# Altium schematic sheet REV04.SchDoc
size A
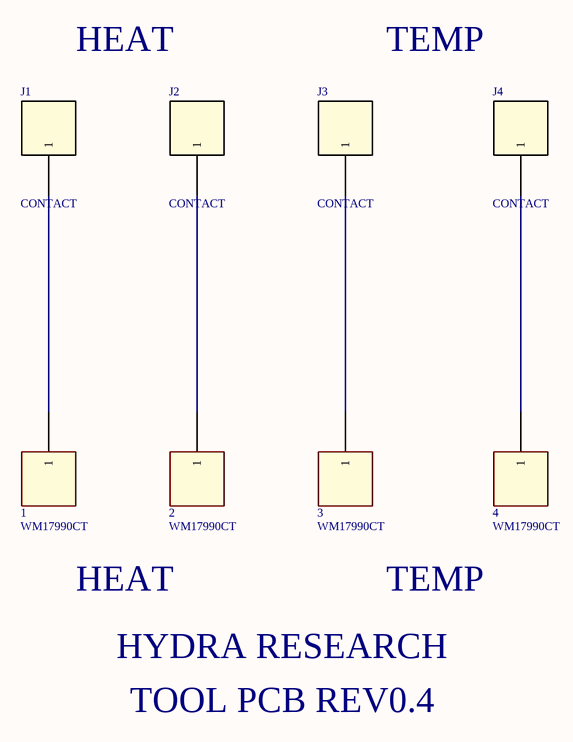
[diagram p0: REV04.SchDoc]

## Parts
1  WM17990CT  [WM17990CT-ND-l]
2  WM17990CT  [WM17990CT-ND-l]
3  WM17990CT  [WM17990CT-ND-l]
4  WM17990CT  [WM17990CT-ND-l]
J1  CONTACT  [CONTRACT PAD]
J2  CONTACT  [CONTRACT PAD]
J3  CONTACT  [CONTRACT PAD]
J4  CONTACT  [CONTRACT PAD]

## Nets
Net1_1: 1.1 J1.1
Net2_1: 2.1 J2.1
Net3_1: 3.1 J3.1
Net4_1: 4.1 J4.1

## Notes on the sheet
- HEAT
- TEMP
- HYDRA RESEARCH
- TOOL PCB REV0.4

## Library data of the parts
1-4 = WM17990CT: MPN: WM17990CT-ND
J1-J4 = CONTACT: MPN: N/C